# Altium schematic sheet MidWifi.SchDoc
size A4
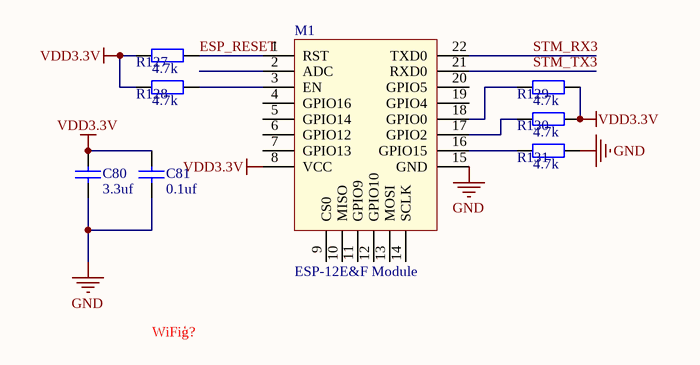
[diagram p0: MidWifi.SchDoc]

## Parts
C80  value 3.3uf  [C0805]  (hidden comment: Cap)
C81  value 0.1uf  [C0805]  (hidden comment: Cap)
M1  ESP-12E&F Module  [ESP-12E&F Module]
R127  value 4.7k  [0805]  (hidden comment: Res2)
R128  value 4.7k  [0805]  (hidden comment: Res2)
R129  value 4.7k  [0805]  (hidden comment: Res2)
R130  value 4.7k  [0805]  (hidden comment: Res2)
R131  value 4.7k  [0805]  (hidden comment: Res2)

## Nets
GND: C80.2 C81.2 M1.15(GND) R131.1
VDD3.3V: C80.1 C81.1 M1.8(VCC) R127.2 R128.2 R129.1 R130.1
ESP_RESET: M1.1(RST) R127.1
STM_RX3: M1.22(TXD0)
STM_TX3: M1.21(RXD0)
NetM1_3: M1.3(EN) R128.1
NetM1_16: M1.16(GPIO15) R131.2
NetM1_17: M1.17(GPIO2) R130.2
NetM1_18: M1.18(GPIO0) R129.2

Not connected (* = marked no-connect by the designer): M1 2(ADC) 4(GPIO16) 5(GPIO14) 6(GPIO12) 7(GPIO13) 9(CS0) 10(MISO) 11(GPIO9) 12(GPIO10) 13(MOSI) 14(SCLK) 19(GPIO4) 20(GPIO5)

## Notes on the sheet
- WiFiģ?

## Library data of the parts
C80 C81 = Cap: Capacitor; Manufacturer: Generic Components; Class: Passive; Published: 08/06/2000; Publisher: Altium Hobart Technology Centre; SubClass: Capacitor
R127-R131 = RES